# Altium schematic sheet 00_Block_Diagram.SchDoc
size A; SheetNumber: 1; SheetTotal: 6
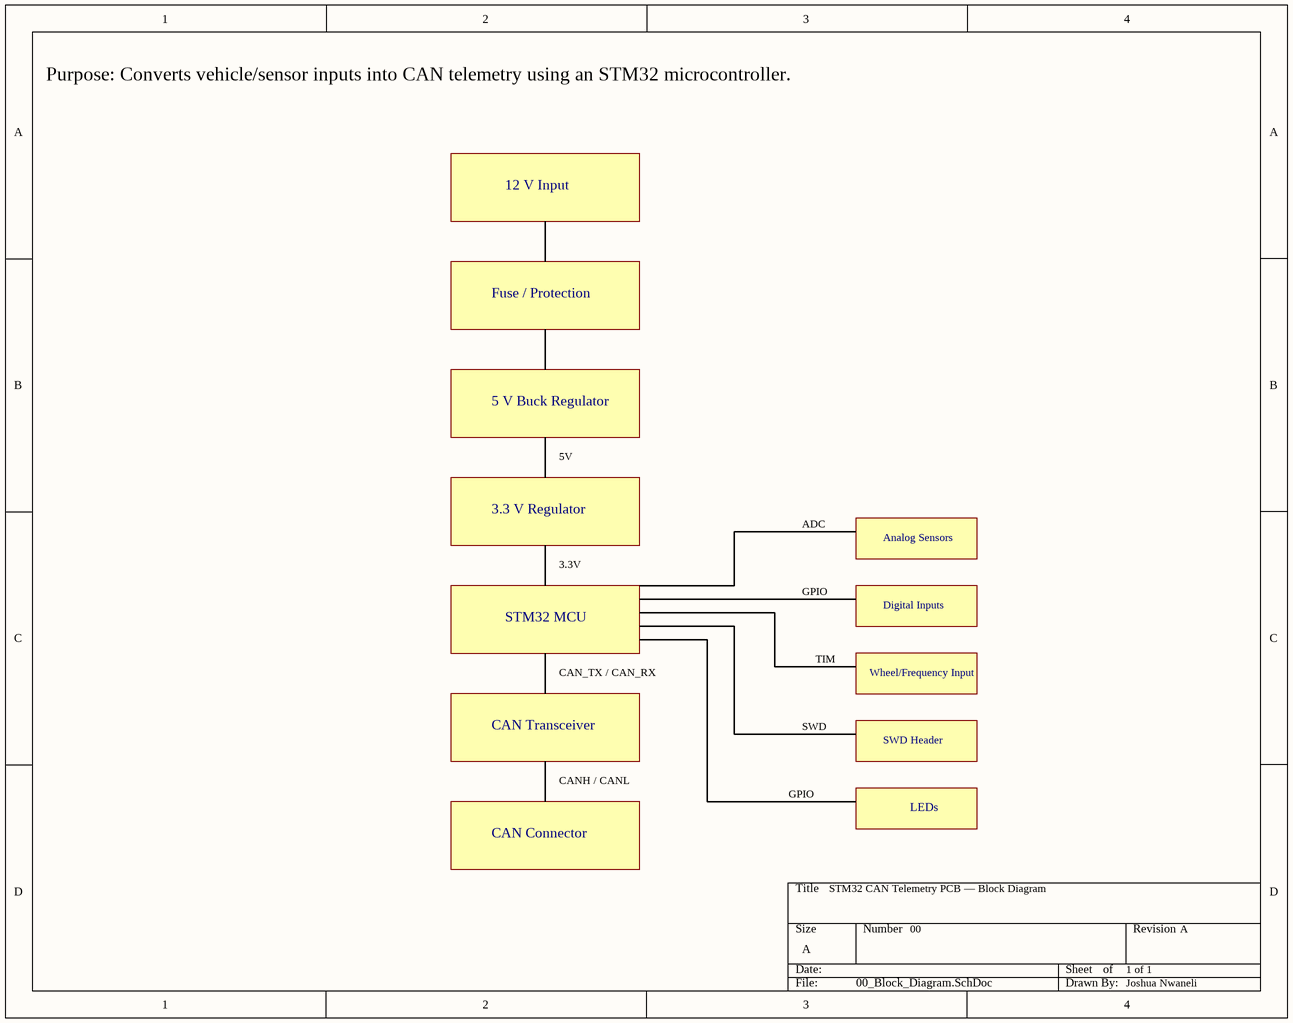
[diagram p0: 00_Block_Diagram.SchDoc]

## Notes on the sheet
- Purpose: Converts vehicle/sensor inputs into CAN telemetry using an STM32 microcontroller.
- 12 V Input
- Fuse / Protection
- 5 V Buck Regulator
- 5V
- 3.3 V Regulator
- 3.3V
- ADC
- Analog Sensors
- STM32 MCU
- GPIO
- Digital Inputs
- CAN_TX / CAN_RX
- TIM
- Wheel/Frequency Input
- CAN Transceiver
- SWD
- SWD Header
- CAN Connector
- CANH / CANL
- LEDs
- STM32 CAN Telemetry PCB — Block Diagram
- 00
- 1 of 1
- A
- Joshua Nwaneli